# Altium project GD32F150_CoreBoard.PrjPcb
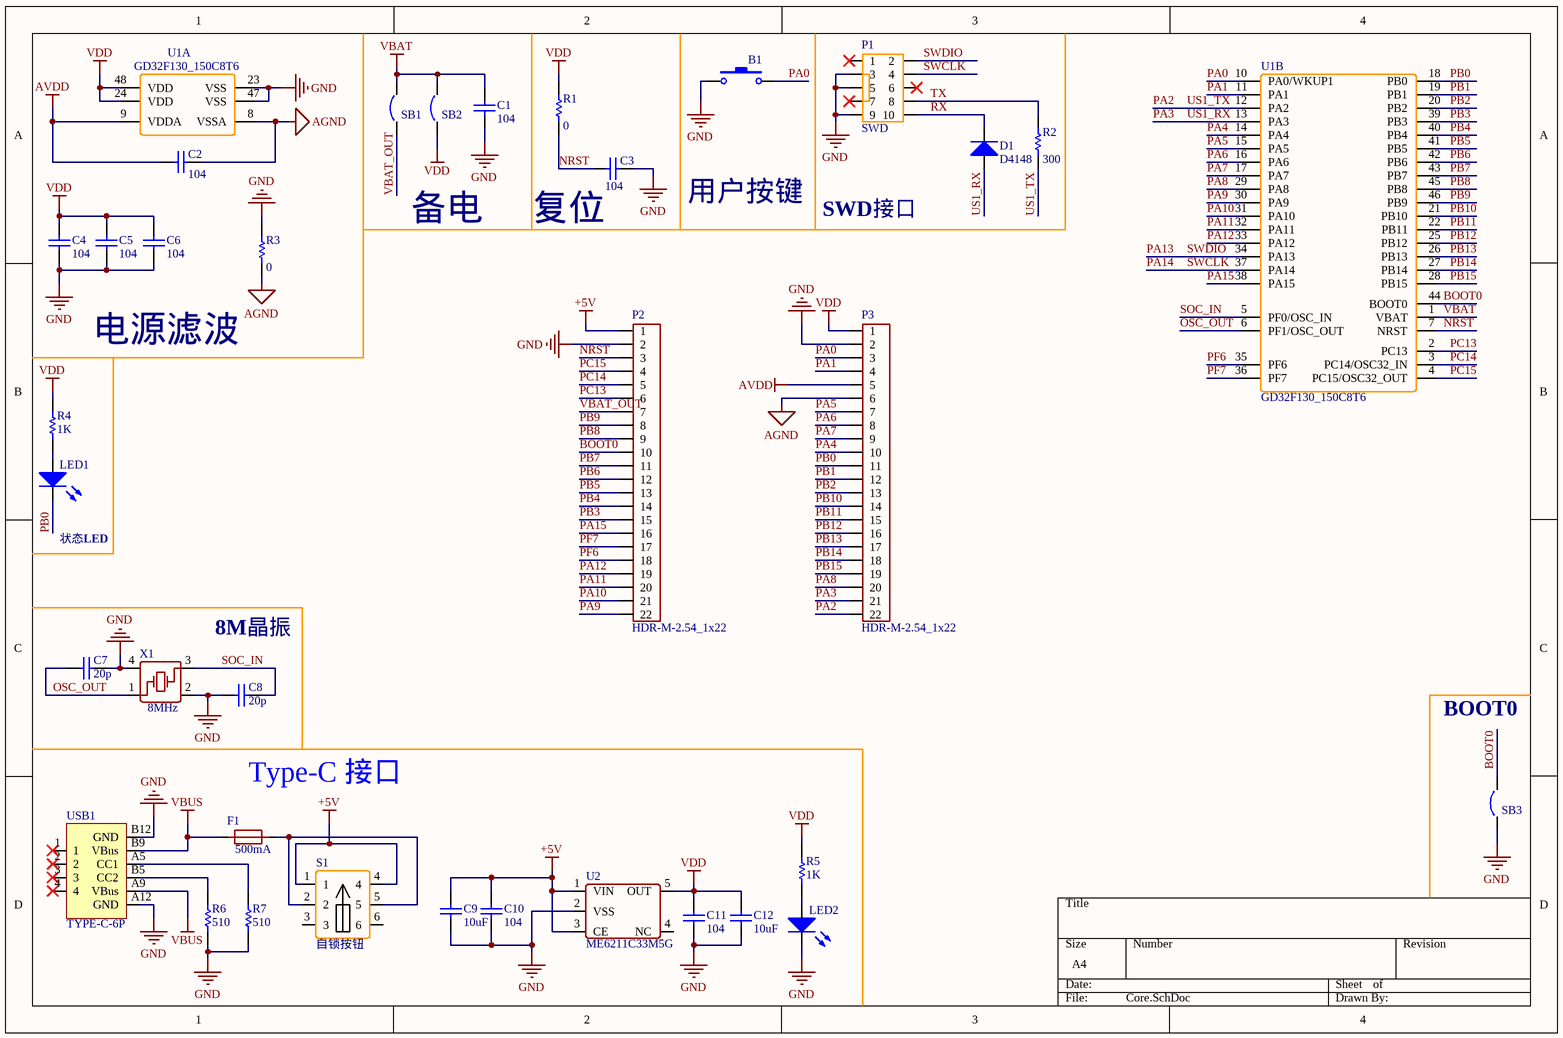
[diagram p0: Core.SchDoc]
1 sheet, 35 parts. Net scope: global (net labels, ports and power ports of the same name join across sheets).
Board file: GD32F150C8_CoreBoard.PcbDoc

## Sheet Core.SchDoc: GD32F150_CoreBoard
size A4; Revision: V1.1; SheetNumber: 1; SheetTotal: 1

### Parts
B1  Button  [SW-SMD_L6.0-W3.5-LS8.0]  (value not drawn)
C1  value 104  [C0402]  (hidden comment: Cap)
C2  value 104  [C0402]  (hidden comment: Cap)
C3  value 104  [C0402]  (hidden comment: Cap)
C4  value 104  [C0402]  (hidden comment: Cap)
C5  value 104  [C0402]  (hidden comment: Cap)
C6  value 104  [C0402]  (hidden comment: Cap)
C7  value 20p  [C0603]  (hidden comment: Cap)
C8  value 20p  [C0603]  (hidden comment: Cap)
C9  value 10uF  [C0603]  (hidden comment: Cap)
C10  value 104  [C0402]  (hidden comment: Cap)
C11  value 104  [C0402]  (hidden comment: Cap)
C12  value 10uF  [C0603]  (hidden comment: Cap)
D1  D4148  [SOD-80_L3.5-W1.5-RD]
F1  500mA  [F0603]
LED1  LED  [LED0603_RED]  (value not drawn)
LED2  LED  [LED0603_RED]  (value not drawn)
P1  SWD  [IDC-SMD-10P-1.27MM]
P2  HDR-M-2.54_1x22  [HDR1X22-MALE]
P3  HDR-M-2.54_1x22  [HDR1X22-MALE]
R1  value 0  [R0402]  (hidden comment: Res)
R2  value 300  [R0402]  (hidden comment: Res)
R3  value 0  [R0402]  (hidden comment: Res)
R4  value 1K  [R0402]  (hidden comment: Res)
R5  value 1K  [R0402]  (hidden comment: Res)
R6  value 510  [R0402]  (hidden comment: Res)
R7  value 510  [R0402]  (hidden comment: Res)
S1  自锁按钮  [SW-TH_5.8ZSGT]
SB1  Circuit Breaker  [JP2_SMD]  (value not drawn)
SB2  Circuit Breaker  [JP2_SMD]  (value not drawn)
SB3  Circuit Breaker  [JP2_SMD]  (value not drawn)
U1  GD32F130_150C8T6  [LQFP48 7X7]  (parts A,B of 2)
U2  ME6211C33M5G  [SOT-23-5L]
USB1  TYPE-C-6P  [USB-C-SMD_6P]
X1  8MHz  [SMD-5032]

### Nets
+5V: C9.2 C10.2 P2.1 S1.1 S1.4 U2.1(VIN) U2.3(CE)
AGND: C2.2 P3.6 R3.1 U1.8(VSSA)
AVDD: C2.1 P3.5 U1.9(VDDA)
GND: B1.1 C1.1 C3.1 C4.1 C5.1 C6.1 C7.1 C8.2 C9.1 C10.1 C11.1 C12.1 LED2.2(K) P1.3 P1.5 P1.9 P2.2 P3.2 R3.2 R6.2 R7.2 SB3.1 U1.23(VSS) U1.47(VSS) U2.2(VSS) USB1.A12(GND) USB1.B12(GND) X1.2 X1.4
VBAT: C1.2 SB1.2 SB2.2 U1.1(VBAT)
VBUS: F1.1 USB1.A9(VBus) USB1.B9(VBus)
VDD: C4.2 C5.2 C6.2 C11.2 C12.2 P3.1 R1.2 R4.2 R5.2 SB2.1 U1.24(VDD) U1.48(VDD) U2.5(OUT)
BOOT0: P2.10 SB3.2 U1.44(BOOT0)
NRST: C3.2 P2.3 R1.1 U1.7(NRST)
OSC_OUT: C7.2 U1.6(PF1/OSC_OUT) X1.1(OSC1)
PA0: B1.2 P3.3 U1.10(PA0/WKUP1)
PA1: P3.4 U1.11(PA1)
PA2: P3.22 R2.1 U1.12(PA2)  [also labelled US1_TX]
PA3: D1.2(A) P3.21 U1.13(PA3)  [also labelled US1_RX]
PA4: P3.10 U1.14(PA4)
PA5: P3.7 U1.15(PA5)
PA6: P3.8 U1.16(PA6)
PA7: P3.9 U1.17(PA7)
PA8: P3.20 U1.29(PA8)
PA9: P2.22 U1.30(PA9)
PA10: P2.21 U1.31(PA10)
PA11: P2.20 U1.32(PA11)
PA12: P2.19 U1.33(PA12)
PA13: P1.2 U1.34(PA13)  [also labelled SWDIO]
PA14: P1.4 U1.37(PA14)  [also labelled SWCLK]
PA15: P2.16 U1.38(PA15)
PB0: LED1.2(K) P3.11 U1.18(PB0)
PB1: P3.12 U1.19(PB1)
PB2: P3.13 U1.20(PB2)
PB3: P2.15 U1.39(PB3)
PB4: P2.14 U1.40(PB4)
PB5: P2.13 U1.41(PB5)
PB6: P2.12 U1.42(PB6)
PB7: P2.11 U1.43(PB7)
PB8: P2.9 U1.45(PB8)
PB9: P2.8 U1.46(PB9)
PB10: P3.14 U1.21(PB10)
PB11: P3.15 U1.22(PB11)
PB12: P3.16 U1.25(PB12)
PB13: P3.17 U1.26(PB13)
PB14: P3.18 U1.27(PB14)
PB15: P3.19 U1.28(PB15)
PC13: P2.6 U1.2(PC13)
PC14: P2.5 U1.3(PC14/OSC32_IN)
PC15: P2.4 U1.4(PC15/OSC32_OUT)
PF6: P2.18 U1.35(PF6)
PF7: P2.17 U1.36(PF7)
RX: D1.1(K) P1.10
SOC_IN: C8.1 U1.5(PF0/OSC_IN) X1.3(OSC2)
TX: P1.8 R2.2
VBAT_OUT: P2.7 SB1.1
NetF1_2: F1.2 S1.2 S1.5
NetLED1_1: LED1.1(A) R4.1
NetLED2_1: LED2.1(A) R5.1
NetR6_1: R6.1 USB1.B5(CC2)
NetR7_1: R7.1 USB1.A5(CC1)

Not connected (* = marked no-connect by the designer): P1 1* 6* 7*; S1 3 6; U2 4(NC); USB1 1* 2* 3* 4*

### Notes on the sheet
- 备电
- 复位
- 用户按键
- SWD接口
- 电源滤波
- (near LED1) 状态LED
- 8M晶振
- BOOT0
- Type-C 接口

### Library data of the parts
B1 = Button: 轻触按钮 - Switch; Published: 24-Mar-1999; LatestRevisionDate: 17-Jul-2002; LatestRevisionNote: Re-released for DXP Platform.; PackageReference: SPST-2; Publisher: Altium Limited; PackageDescription: Switch; 2 Leads
C1-C12 = Cap: 无极性电容; Publisher: 信念D力量
D1 = D4148: 4148二极管
F1 = Fuse 1: 保险丝 - Fuse
LED1 LED2 = LED: 发光二极管
P1 = IDC-2x5: 牛角座
P2 P3 = HDR-M-2.54_1x22: 排针，2.54MM
R1-R7 = Res: 美国电阻符号; Published: 8-Jun-2000; LatestRevisionDate: 29-May-2009; LatestRevisionNote: IPC-7351 Footprint Added.; PackageReference: J1-0603; Publisher: Altium Limited; PackageDescription: Chip Resistor
S1 = 自锁按钮: 自锁按钮开个
SB1-SB3 = Circuit Breaker: 断路器 短路选择 - Circuit Breaker; Solder: NO; Published: 24-Mar-1999; Revision: July-2002: Re-released for DXP Platform.; Publisher: Altium Limited
U1 = GD32F130_150C8T6: GD32 单片机
U2 = ME6211C33M5G: 3.3V LDO 线性稳压，带使能控制
USB1 = TYPE-C-6P: Type-C USB，6P
X1 = XTAL-4: 4脚晶振